# EasyEDA schematic SCH_d_01_ex_00.json
TITLE: EX00; REV: 1.0; Date: 2025-01-11; Sheet: 1/1; Drawn By: artem.v.ulyanov; Company: provemet
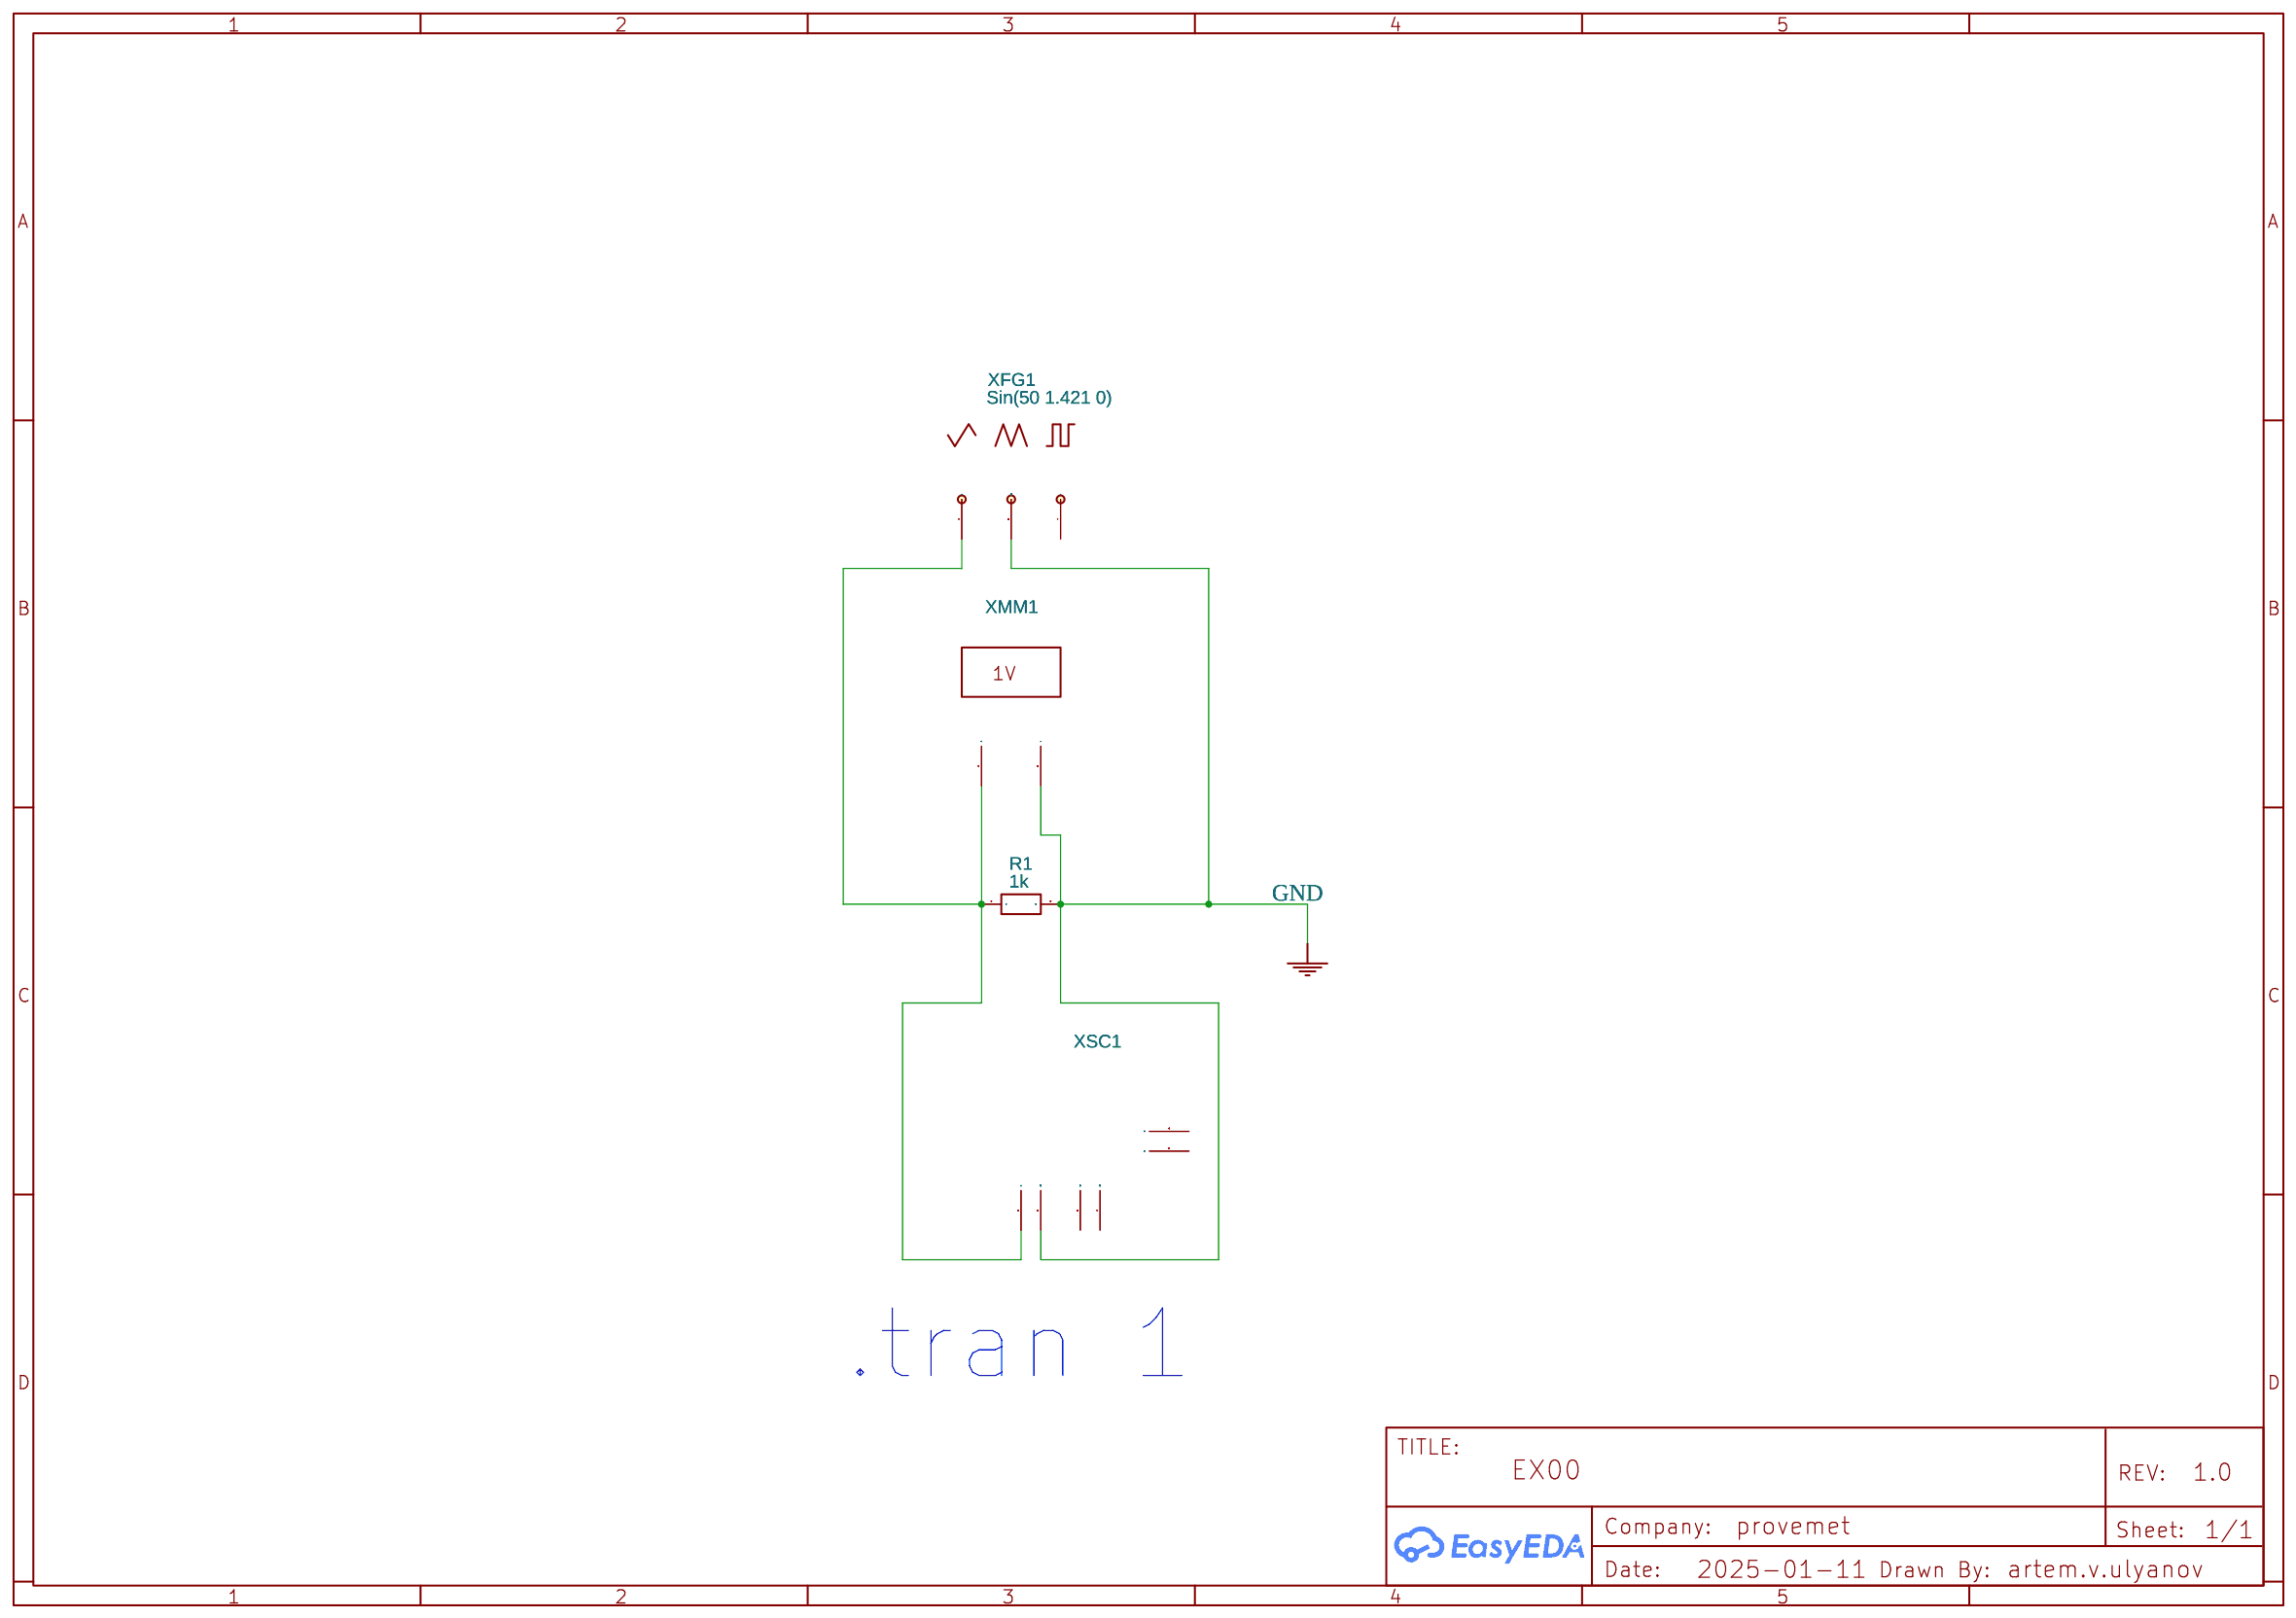
[diagram p0: schematic sheet]

## Parts
R1  1k  [R0603]
XFG1  Sin(50 1.421 0)
XMM1  Multimeter
XSC1  Oscilloscope

## Library data of the parts
R1 = R_0603_EU: Contributor: LCEDA_Lib
XFG1 = FUNCTIONGENERATOR: Supplier: LCSC; Waveforms: Sine Wave; Frequency: 50; Duty cycle: 50; Amplitude: 1.421; Offset: 0; Rise/Fall Time: 10; NameDisplay: 1; Contributor: EasyEDA; sim: true
XMM1 = MULTIMETER: Supplier: LCSC; Multimeter Type: Voltmeter; Power Type: AC; Voltmeter resistance: 10μ; Ammeter resistance: 1G; NameDisplay: 0; Contributor: EasyEDA; sim: true
XSC1 = OSCILLOSCOPE: Contributor: EasyEDA; NameDisplay: 0; sim: true

## Nets
GND: R1.2 XFG1.COM XMM1.2(I) XSC1.2(GND1)
Net-(R1-1): R1.1 XFG1.+ XMM1.1(+) XSC1.1(A)

Not connected (* = marked no-connect by the designer): XFG1 -; XSC1 3(B) 4(GND2) 5(T+) 6(T-)

## Notes on the sheet
- .tran 1
